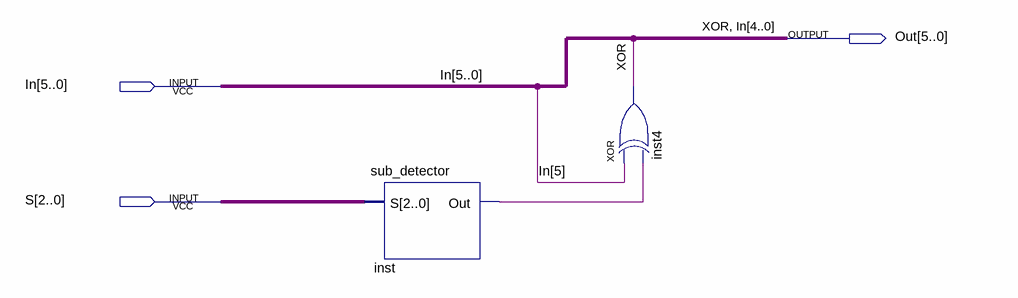
[diagram p0: schematic sheet]
// Quartus schematic input_handler.bdf as structural Verilog: 2 symbols, 3 pins
module input_handler (
  input  [5:0] In,
  input  [2:0] S,
  output [5:0] Out
);

  wire inst_out;

  sub_detector inst (.S(S), .Out(inst_out));
  xor inst4 (Out[5], In[5], inst_out);

  assign Out[4:0] = In[4:0];

  // Other names for the same wires on the sheet: XOR = Out[5]
endmodule
